# Altium schematic sheet STLink_V3E_Module.SchDoc: STLink V3E Module
size A4; Date: Not used; ApprovedBy: Not used; CheckedBy: Not used; Author: Not used; CompanyName: STMicroelectronics; DrawnBy: Not used; Engineer: Not used; Organization: Not used; Address1: Not used; Address2: Not used; Address3: Not used; Address4: Not used; DocumentNumber: Not used; Revision: Not used; SheetNumber: 4; SheetTotal: 7; CurrentTime: Not used; CurrentDate: Not used; Time: Not used; DocumentFullPathAndName: Not used; DocumentName: Not used; ModifiedDate: Not used; ImagePath: Not used; ProjectName: Not used; Application_BuildNumber: Not used
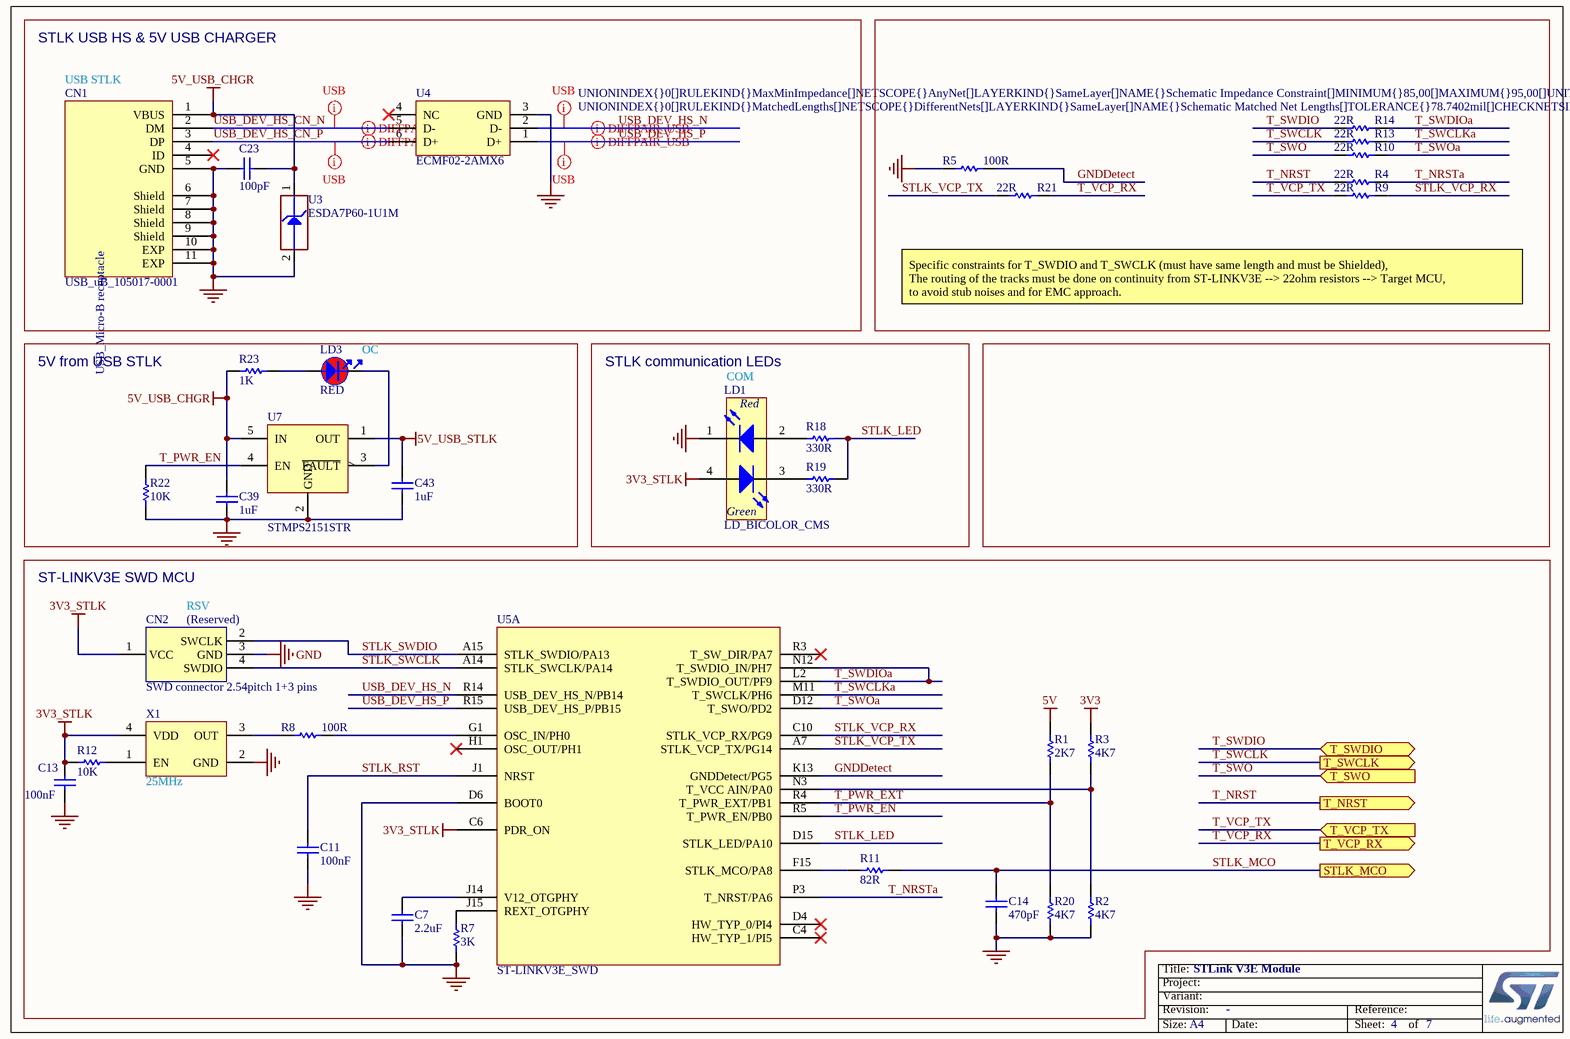
[diagram p0: STLink_V3E_Module.SchDoc]

## Parts
C7  value 2.2uF  [C0603]
C11  value 100nF  [C0402]
C13  value 100nF  [C0402]
C14  value 470pF  [C0402]  (hidden comment: Capacitor)
C23  value 100pF  [C0402]
C39  value 1uF  [C0603]
C43  value 1uF  [C0603]
CN1  value USB_uB_105017-0001  [CON_USBMICROB_MOLEX_105017-0001_H2P90]
CN2  value SWD connector 2.54pitch 1+3 pins  [CON_SAMTEC_TSW-103-07-X-D_CUSTOM_4PINS__V1-3]
LD1  value LD_BICOLOR_CMS  [LED_BI-GR_HSMF-A201-A00J1]
LD3  value RED  [LED_0603_RED_H0P4]
R1  value 2K7  [R0402]
R2  value 4K7  [R0402]
R3  value 4K7  [R0402]
R4  value 22R  [R0402]
R5  value 100R  [R0402]
R7  value 3K  [R0402]
R8  value 100R  [R0402]
R9  value 22R  [R0402]
R10  value 22R  [R0402]
R11  value 82R  [R0402]  (hidden comment: Resistor)
R12  value 10K  [R0402]
R13  value 22R  [R0402]
R14  value 22R  [R0402]
R18  value 330R  [R0603]
R19  value 330R  [R0603]
R20  value 4K7  [R0402]
R21  value 22R  [R0402]
R22  value 10K  [R0402]
R23  value 1K  [R0603]
U3  value ESDA7P60-1U1M  [ESD_QFN2_1P6X1_P125]
U4  value ECMF02-2AMX6  [ESD_QFN-6L_1P7X1P5_P050]
U5  value ST-LINKV3E_SWD  [ICC_UFBGA201_176+25_10X10_P065]  (part A of 2)
U7  value STMPS2151STR  [MOS_SOT23-5L]
X1  value 25MHz  [OSC_NDK_NZ2520SB_4P]

## Blocks framed on the sheet
STLK USB HS & 5V USB CHARGER: C23 CN1 U3 U4
5V from USB STLK: C39 C43 LD3 R22 R23 U7
STLK communication LEDs: LD1 R18 R19
ST-LINKV3E SWD MCU: C7 C11 C13 C14 CN2 R1-R3 R7 R8 R11 R12 R20 U5 X1

## Ports
STLK_MCO, T_NRST, T_SWCLK, T_SWDIO, T_SWO, T_VCP_RX, T_VCP_TX

## Nets
3V3: R3.2
3V3_STLK: C13.2 CN2.1(VCC) LD1.4(YellowGreen_anode) R12.1 U5.C6(PDR_ON) X1.4(VDD)
5V: R1.2
5V_USB_CHGR: C23.2 C39.2 CN1.1(VBUS) R23.1 U3.1(IO1) U7.5(IN)
5V_USB_STLK: C43.2 U7.1(OUT)
GND: C7.1 C11.1 C13.1 C14.1 C23.1 C39.1 C43.1 CN1.5(GND) CN1.6(Shield) CN1.7(Shield) CN1.8(Shield) CN1.9(Shield) CN1.10(EXP) CN1.11(EXP) CN2.3(GND) LD1.1(RED_cathode) R2.1 R5.1 R7.1 R20.1 R22.1 U3.2(GND) U4.3(GND) U5.D6(BOOT0) U7.2(GND) X1.2(GND)
GNDDetect: R5.2 U5.K13(GNDDetect/PG5)
STLK_LED: R18.2 R19.2 U5.D15(STLK_LED/PA10)
STLK_MCO: C14.2 R11.2 ; port STLK_MCO
STLK_RST: C11.2 U5.J1(NRST)
STLK_SWCLK: CN2.4(SWDIO) U5.A14(STLK_SWCLK/PA14)
STLK_SWDIO: CN2.2(SWCLK) U5.A15(STLK_SWDIO/PA13)
STLK_VCP_RX: R9.2 U5.C10(STLK_VCP_RX/PG9)
STLK_VCP_TX: R21.1 U5.A7(STLK_VCP_TX/PG14)
T_NRST: R4.1 ; port T_NRST
T_NRSTa: R4.2 U5.P3(T_NRST/PA6)
T_PWR_EN: R22.2 U5.R5(T_PWR_EN/PB0) U7.4(EN)
T_PWR_EXT: R1.1 R20.2 U5.R4(T_PWR_EXT/PB1)
T_SWCLK: R13.1 ; port T_SWCLK
T_SWCLKa: R13.2 U5.M11(T_SWCLK/PH6)
T_SWDIO: R14.1 ; port T_SWDIO
T_SWDIOa: R14.2 U5.L2(T_SWDIO_OUT/PF9) U5.N12(T_SWDIO_IN/PH7)
T_SWO: R10.1 ; port T_SWO
T_SWOa: R10.2 U5.D12(T_SWO/PD2)
T_VCP_RX: R21.2 ; port T_VCP_RX
T_VCP_TX: R9.1 ; port T_VCP_TX
USB_DEV_HS_CN_N: CN1.2(DM) U4.5(D-)
USB_DEV_HS_CN_P: CN1.3(DP) U4.6(D+)
USB_DEV_HS_N: U4.2(D-) U5.R14(USB_DEV_HS_N/PB14)
USB_DEV_HS_P: U4.1(D+) U5.R15(USB_DEV_HS_P/PB15)
NetC7_2: C7.2 U5.J14(V12_OTGPHY)
NetLD1_2: LD1.2(Red_anode) R18.1
NetLD1_3: LD1.3(YellowGreen_cathode) R19.1
NetLD3_1: LD3.1 R23.2
NetLD3_2: LD3.2 U7.3(~{FAULT})
NetR2_2: R2.2 R3.1 U5.N3(T_VCC_AIN/PA0)
NetR7_2: R7.2 U5.J15(REXT_OTGPHY)
NetR8_1: R8.1 X1.3(OUT)
NetR8_2: R8.2 U5.G1(OSC_IN/PH0)
NetR11_1: R11.1 U5.F15(STLK_MCO/PA8)
NetR12_2: R12.2 X1.1(EN)

Not connected (* = marked no-connect by the designer): CN1 4(ID)*; U4 4(NC)*; U5 C4(HW_TYP_1/PI5)* D4(HW_TYP_0/PI4)* H1(OSC_OUT/PH1)* R3(T_SW_DIR/PA7)*

## Layout directives
differential pair; rule Impedance Constraint [Min = 85.00    Max = 95.00    ]: USB_DEV_HS_CN_N, USB_DEV_HS_CN_P, USB_DEV_HS_N, USB_DEV_HS_P
rule Undefined; rule Matched Net Lengths [Tolerance = 2mm]; rule Impedance Constraint [Min = 85.00    Max = 95.00    ]: USB_DEV_HS_CN_N, USB_DEV_HS_CN_P, USB_DEV_HS_N, USB_DEV_HS_P

## Notes on the sheet
- USB STLK
- Specific constraints for T_SWDIO and T_SWCLK (must have same length and must be Shielded),
  The routing of the tracks must be done on continuity from ST-LINKV3E --> 22ohm resistors --> Target MCU,
  to avoid stub noises and for EMC approach.
- (near LD3) OC
- COM
- (near CN2) (Reserved)
- (near CN2) RSV
- Title:
- Project:
- Size:
- Revision:
- Variant:
- A4
- -
- Date:
- Reference:
- Sheet:
- of
- (in symbol MCD-00028) USB_Micro-B receptacle
- (in symbol MCD-00051) Red; Green

## Library data of the parts
C7 = MCD-00012: Capacitor, MLCC, 2.2uF, 10V, X5R, 10%, 0603, T=0,8mm; Manufacturer_Part_Number: CC0603KRX5R6BB225; Manufacturer: YAGEO; Alternate_Manufacturer_Part_Number: C0603C225K8PACTU; Alternate_Manufacturer: KEMET; Provided_By: SUBCO; Initial_Board_Reference: MB1274; Internal_Part_Number: MCD-00012; Status: Released; Package: C0603; ComponentLink1Description: Datasheet; Part_Type: Capacitor; ComponentLink1URL: http://tunmcdsvn.tun.st.com/Component_Datasheet_Library/Trunk/Capacitors/Yageo_Multilayer_capacitor_X5R_series_100pF_to_100uF
C11 C13 = MCD-00102: Capacitor, MLCC, 100nF, 16V, X7R, 10%, 0402, T=0,5mm; Manufacturer_Part_Number: CC0402KRX7R7BB104; Manufacturer: YAGEO; Provided_By: SUBCO; Initial_Board_Reference: MB1262; Internal_Part_Number: MCD-00102; Status: Released; Package: C0402; ComponentLink1Description: Datasheet; Part_Type: Capacitor; ComponentLink1URL: http://tunmcdsvn.tun.st.com/Component_Datasheet_Library/Trunk/Capacitors/Yageo_Multilayer_Capacitor_X7R_series_100pF_to_22uF
C14 = MCD-00724: Capacitor, MLCC, 470pF, 50V, NPO, 5%, 0402, T=0,5mm; Manufacturer_Part_Number: CC0402JRNPO9BN471; Manufacturer: YAGEO; Provided_By: SUBCO; Internal_Part_Number: MCD-00724; Status: Released; Part_Type: Capacitor; Package: C0402; ComponentLink1Description: Datasheet; ComponentLink1URL: http://tunmcdsvn.tun.st.com/Component_Datasheet_Library/Trunk/Capacitors/Yageo_Capacitor_NP0_16V-to-50V
C23 = MCD-00205: Capacitor, MLCC, 100pF, 50V, NPO, 5%, 0402, T=0,5mm; Manufacturer_Part_Number: CC0402JRNPO9BN101; Manufacturer: YAGEO; Provided_By: SUBCO; Initial_Board_Reference: MB1361; Internal_Part_Number: MCD-00205; Status: Released; Part_Type: Capacitor; Package: C0402; ComponentLink1Description: Datasheet; ComponentLink1URL: http://tunmcdsvn.tun.st.com/Component_Datasheet_Library/Trunk/Capacitors/Yageo_Capacitor_NP0_16V-to-50V
C39 C43 = MCD-00010: Capacitor, MLCC, 1uF, 16V, X5R, 10%, 0603, T=0,8mm; Manufacturer_Part_Number: CC0603KRX5R7BB105; Manufacturer: YAGEO; Provided_By: SUBCO; Initial_Board_Reference: MB1274; Internal_Part_Number: MCD-00010; Status: Released; Package: C0603; ComponentLink1Description: Datasheet; Part_Type: Capacitor; ComponentLink1URL: http://tunmcdsvn.tun.st.com/Component_Datasheet_Library/Trunk/Capacitors/Yageo_Multilayer_capacitor_X5R_series_100pF_to_100uF
CN1 = MCD-00028: USB-MICRO-B, 0.65mm, RA, SMT, Bottom Mount,; Manufacturer_Part_Number: 1050170001; Manufacturer: MOLEX; Part_Type: Connector; Provided_By: SUBCO; Initial_Board_Reference: MB1274; Internal_Part_Number: MCD-00028; Status: Released; ComponentLink1Description: Datasheet; ComponentLink1URL: http://tunmcdsvn.tun.st.com/Component_Datasheet_Library/Trunk/Connectors/Molex_Connector-USB-microB_105017-0001
CN2 = MCD-01430: SWD connector 2.54pitch 1+3 pins - not fitted; Manufacturer_Part_Number: na; Initial_Board_Reference: MB1430; Internal_Part_Number: MCD-01430; Status: Checked; Part_Type: Connector; Manufacturer: na; ComponentLink1Description: Datasheet; ComponentLink1URL: http://tunmcdsvn.tun.st.com/Component_Datasheet_Library/Trunk/Connectors/Samtec_TSW-HTSW-series; Provided_By: n/a
LD1 = MCD-00051: LED Bicolor; Part_Type: Display; Manufacturer_Part_Number: HSMF-A201-A00J1; Manufacturer: AVAGO TECHNOLOGIES; Alternate_Manufacturer_Part_Number: LE-RGW35280; Alternate_Manufacturer: EVERLUCK; Provided_By: SUBCO; Initial_Board_Reference: MB1274; Internal_Part_Number: MCD-00051; Status: Released; ComponentLink1Description: Datasheet; ComponentLink1URL: http://tunmcdsvn.tun.st.com/Component_Datasheet_Library/Trunk/Display/Avago_LED-SMC_HSMx-A2xx-02Feb2012
LD3 = MCD-00322: LED, Red, 0603; Part_Type: Display; Manufacturer_Part_Number: 19-217/R6C-AL1M2VY/3T; Manufacturer: EVERLIGHT; Provided_By: SUBCO; Initial_Board_Reference: MB1311; Internal_Part_Number: MCD-00322; Status: Released; Package: LED 0603; ComponentLink1Description: Datasheet; ComponentLink1URL: http://tunmcdsvn.tun.st.com/Component_Datasheet_Library/Trunk/Display/Everlight_SMD-LED-RED_19-213-R6C-AP1Q2B-3T-V3.doc
R1 = MCD-00055: Resistor,2K7,0402,1%,1/16W; Manufacturer_Part_Number: RC0402FR-072K7L; Manufacturer: YAGEO; Provided_By: SUBCO; Initial_Board_Reference: MB1274; Internal_Part_Number: MCD-00055; Status: Released; ComponentLink1Description: Datasheet; Part_Type: Resistor; Package: R0402; ComponentLink1URL: http://tunmcdsvn.tun.st.com/Component_Datasheet_Library/Trunk/Resistors/Yageo_Resistor_RC0402-series
R2 R3 R20 = MCD-00065: Resistor,4K7,0402,1%,1/16W; Manufacturer_Part_Number: RC0402FR-074K7L; Manufacturer: YAGEO; Alternate_Manufacturer_Part_Number: RT0402FRE074K7L; Provided_By: SUBCO; Initial_Board_Reference: MB1274; Internal_Part_Number: MCD-00065; Status: Released; ComponentLink1Description: Datasheet; Alternate_Manufacturer: YAGEO; Part_Type: Resistor; Package: R0402; ComponentLink1URL: http://tunmcdsvn.tun.st.com/Component_Datasheet_Library/Trunk/Resistors/Yageo_Resistor_RC0402-series
R4 R9 R10 R13 R14 R21 = MCD-00189: Resistor,22R,0402,1%,1/16W; Manufacturer_Part_Number: RC0402FR-0722RL; Manufacturer: YAGEO; Provided_By: SUBCO; Initial_Board_Reference: MBxxxx; Internal_Part_Number: MCD-00189; Status: Released; Part_Type: Resistor; ComponentLink1Description: Datasheet; Package: R0402; ComponentLink1URL: http://tunmcdsvn.tun.st.com/Component_Datasheet_Library/Trunk/Resistors/Yageo_Resistor_RC0402-series
R5 R8 = MCD-00119: Resistor,100R,0402,1%,1/16W; Manufacturer_Part_Number: RC0402FR-07100RL; Manufacturer: YAGEO; Provided_By: SUBCO; Initial_Board_Reference: MB1262; Internal_Part_Number: MCD-00119; Status: Released; Part_Type: Resistor; ComponentLink1Description: Datasheet; Package: R0402; ComponentLink1URL: http://tunmcdsvn.tun.st.com/Component_Datasheet_Library/Trunk/Resistors/Yageo_Resistor_RC0402-series
R7 = MCD-00185: Resistor,3K,0402,1%,1/16W; Manufacturer_Part_Number: RC0402FR-073KL; Manufacturer: YAGEO; Provided_By: SUBCO; Initial_Board_Reference: MBxxxx; Internal_Part_Number: MCD-00185; Status: Released; ComponentLink1Description: Datasheet; Part_Type: Resistor; Package: R0402; ComponentLink1URL: http://tunmcdsvn.tun.st.com/Component_Datasheet_Library/Trunk/Resistors/Yageo_Resistor_RC0402-series
R11 = MCD-00525: Resistor,82R,0402,1%,1/16W; Manufacturer_Part_Number: RC0402FR-0782RL; Manufacturer: YAGEO; Provided_By: SUBCO; Internal_Part_Number: MCD-00525; Status: Released; Part_Type: Resistor; Package: R0402; ComponentLink1Description: Datasheet; ComponentLink1URL: http://tunmcdsvn.tun.st.com/Component_Datasheet_Library/Trunk/Resistors/Yageo_Resistor_RC0402-series
R12 R22 = MCD-00053: Resistor,10K,0402,1%,1/16W; Manufacturer_Part_Number: RC0402FR-0710KL; Manufacturer: YAGEO; Provided_By: SUBCO; Initial_Board_Reference: MB1274; Internal_Part_Number: MCD-00053; Status: Released; ComponentLink1Description: Datasheet; Part_Type: Resistor; Package: R0402; ComponentLink1URL: http://tunmcdsvn.tun.st.com/Component_Datasheet_Library/Trunk/Resistors/Yageo_Resistor_RC0402-series
R18 R19 = MCD-00197: Resistor,330R,0603,1%,1/10W; Manufacturer_Part_Number: RC0603FR-07330RL; Manufacturer: YAGEO; Provided_By: SUBCO; Initial_Board_Reference: MBxxxx; Internal_Part_Number: MCD-00197; Status: Released; ComponentLink1Description: Datasheet; Part_Type: Resistor; Package: R0603; ComponentLink1URL: http://tunmcdsvn.tun.st.com/Component_Datasheet_Library/Trunk/Resistors/Yageo_Resistor_RC0603-series
R23 = MCD-00070: Resistor,1K,0603,1%,1/10W; Manufacturer_Part_Number: RC0603FR-071KL; Manufacturer: YAGEO; Provided_By: SUBCO; Initial_Board_Reference: MB1274; Internal_Part_Number: MCD-00070; Status: Released; ComponentLink1Description: Datasheet; Part_Type: Resistor; Package: R0603; ComponentLink1URL: http://tunmcdsvn.tun.st.com/Component_Datasheet_Library/Trunk/Resistors/Yageo_Resistor_RC0603-series
U3 = MCD-00251: High power transient voltage suppressor, 7V breakdown; Part_Type: Diode; Manufacturer: STMICROELECTRONICS; BMS_Part_Number: 9179042; Provided_By: SUBCO with ST control; Initial_Board_Reference: MB1311; Internal_Part_Number: MCD-00251; Status: Released; Manufacturer_Part_Number: ESDA7P60-1U1M; ComponentLink1Description: Datasheet; ComponentLink1URL: http://tunmcdsvn.tun.st.com/Component_Datasheet_Library/Trunk/Diodes/STM_ESD_ESDA7P60-1U1M
U4 = MCD-00649: Common mode filter with ESD protection for USB 2.0 interface; Part_Type: Diode; Manufacturer: STMICROELECTRONICS; Provided_By: SUBCO with ST control; Initial_Board_Reference: MB1248; Internal_Part_Number: MCD-00649; Status: Checked; Manufacturer_Part_Number: ECMF02-2AMX6; ComponentLink1Description: Datasheet; ComponentLink1URL: http://tunmcdsvn.tun.st.com/Component_Datasheet_Library/Trunk/Diodes/STM_ESD_ECMF02-2AMX6
U5 = MCD-00596: STM32F723IEK  (STM32F7) BGA176; Part_Type: IC; Manufacturer_Part_Number: STM32F723IEK6; Manufacturer: STMICROELECTRONICS; BMS_Part_Number: 9175300; Provided_By: SUBCO with ST control; Initial_Board_Reference: MB1331; Internal_Part_Number: MCD-00596; Status: Checked; ComponentLink1Description: Datasheet; ComponentLink1URL: http://tunmcdsvn.tun.st.com/Component_Datasheet_Library/Trunk/IC/BGA176+25L_10x10x0.6_pitch0.65
U7 = MCD-00159: 500mA, Enhanced single channel power switches with active high enable pin; Part_Type: IC; Manufacturer: STMICROELECTRONICS; Alternate_Manufacturer_Part_Number: TPS2051C; Alternate_Manufacturer: TEXAS INSTRUMENTS; BMS_Part_Number: 9159009; Provided_By: SUBCO with ST control; Initial_Board_Reference: MB1264; Internal_Part_Number: MCD-00159; Status: Checked; Manufacturer_Part_Number: STMPS2151STR; ComponentLink1Description: Datasheet; ComponentLink1URL: http://tunmcdsvn.tun.st.com/Component_Datasheet_Library/Trunk/IC/STM_PWR-Switch_STMPS2151STR
X1 = MCD-00597: Oscillator 25.00Mhz, -+50PPM, 3.3V, Temp -55 to +125°C; Manufacturer_Part_Number: NZ2520SB 25MHz END4869B; Manufacturer: NDK; Alternate_Manufacturer_Part_Number: KC2520B25.0000C10E00; Alternate_Manufacturer: AVX CORP/KYOCERA CORP; Part_Type: Crystal_Osc; BMS_Part_Number: 9157031; Provided_By: ST; Initial_Board_Reference: MB1331; Internal_Part_Number: MCD-00597; Status: Checked; ComponentLink1Description: Datasheet; ComponentLink1URL: http://tunmcdsvn.tun.st.com/Component_Datasheet_Library/Trunk/Crystal_Osc/NDK_OSCILLATOR_NZ2520SB; Order_Code_Digikey: 478-4780-1-ND